# Altium schematic sheet SENSOR_INP.SchDoc
size A4; SheetNumber: 9; SheetTotal: 14
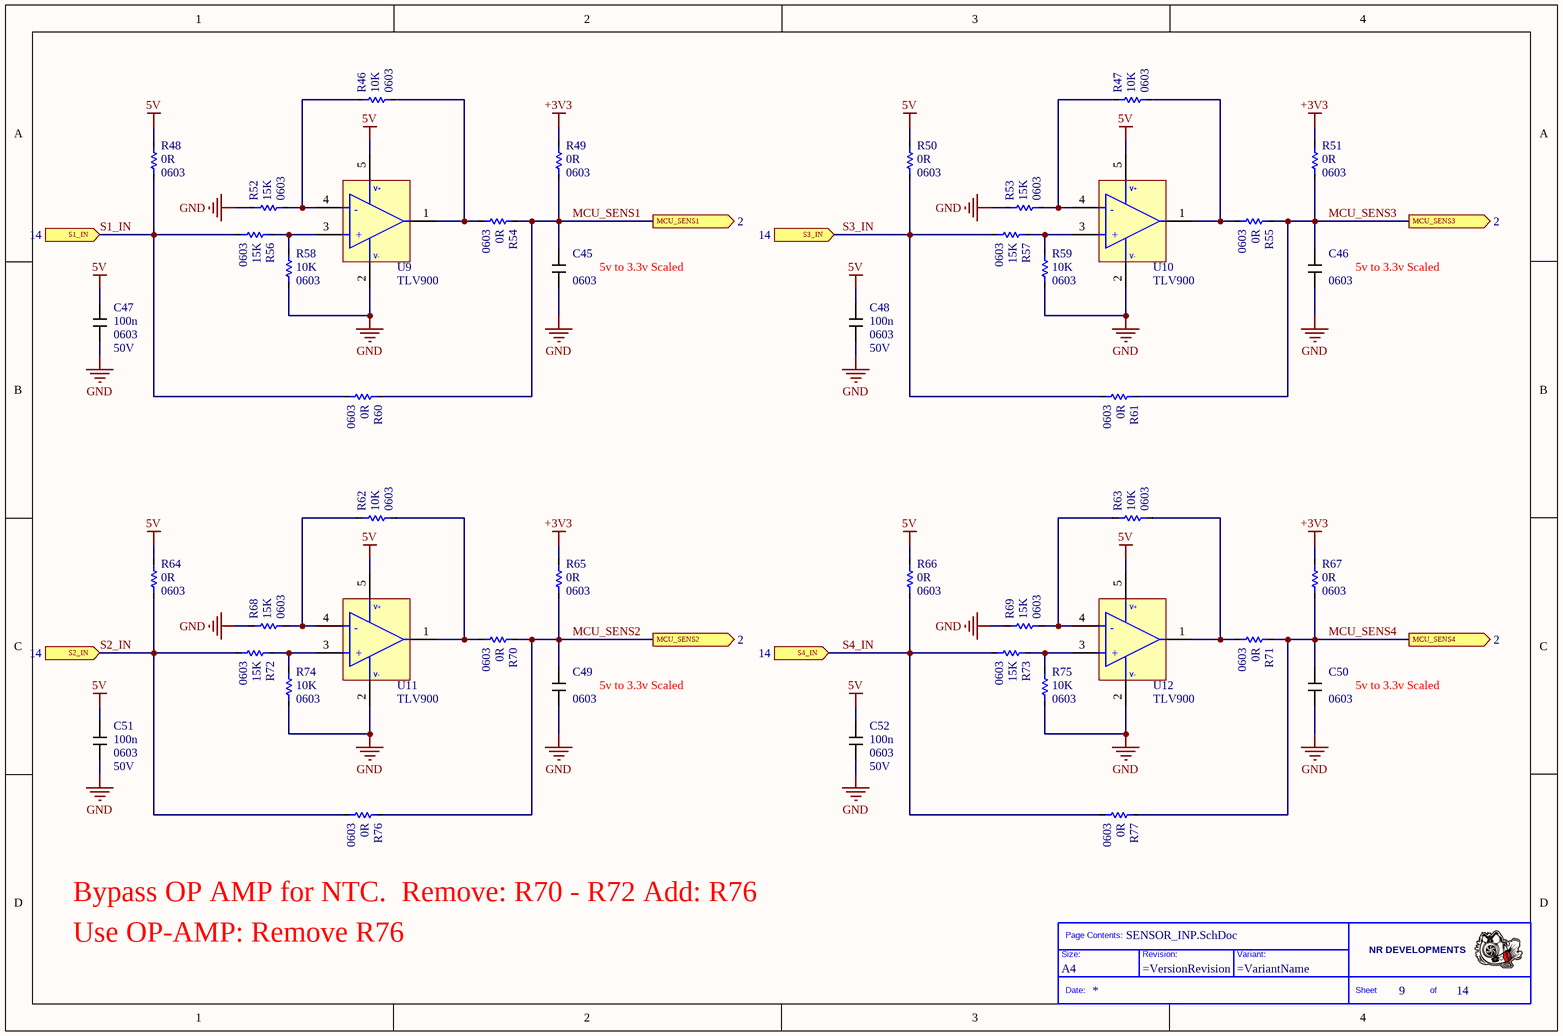
[diagram p0: SENSOR_INP.SchDoc]

## Parts
*?  Size: A4  (hidden comment: Title_Block)  (graphical)
C45  Case: 0603  [CAPC1608X09M]  (hidden comment: CAP)
C46  Case: 0603  [CAPC1608X09M]  (hidden comment: CAP)
C47  value 100n  Case: 0603  Voltage: 50V  [CAPC1608X09M]  (hidden comment: CAP)
C48  value 100n  Case: 0603  Voltage: 50V  [CAPC1608X09M]  (hidden comment: CAP)
C49  Case: 0603  [CAPC1608X09M]  (hidden comment: CAP)
C50  Case: 0603  [CAPC1608X09M]  (hidden comment: CAP)
C51  value 100n  Case: 0603  Voltage: 50V  [CAPC1608X09M]  (hidden comment: CAP)
C52  value 100n  Case: 0603  Voltage: 50V  [CAPC1608X09M]  (hidden comment: CAP)
R46  value 10K  Case: 0603  [RESC1608X06M]  (hidden comment: Res)
R47  value 10K  Case: 0603  [RESC1608X06M]  (hidden comment: Res)
R48  value 0R  Case: 0603  [RESC1608X06M]  (hidden comment: Res)
R49  value 0R  Case: 0603  [RESC1608X06M]  (hidden comment: Res)
R50  value 0R  Case: 0603  [RESC1608X06M]  (hidden comment: Res)
R51  value 0R  Case: 0603  [RESC1608X06M]  (hidden comment: Res)
R52  value 15K  Case: 0603  [RESC1608X06M]  (hidden comment: Res)
R53  value 15K  Case: 0603  [RESC1608X06M]  (hidden comment: Res)
R54  value 0R  Case: 0603  [RESC1608X06M]  (hidden comment: Res)
R55  value 0R  Case: 0603  [RESC1608X06M]  (hidden comment: Res)
R56  value 15K  Case: 0603  [RESC1608X06M]  (hidden comment: Res)
R57  value 15K  Case: 0603  [RESC1608X06M]  (hidden comment: Res)
R58  value 10K  Case: 0603  [RESC1608X06M]  (hidden comment: Res)
R59  value 10K  Case: 0603  [RESC1608X06M]  (hidden comment: Res)
R60  value 0R  Case: 0603  [RESC1608X06M]  (hidden comment: Res)
R61  value 0R  Case: 0603  [RESC1608X06M]  (hidden comment: Res)
R62  value 10K  Case: 0603  [RESC1608X06M]  (hidden comment: Res)
R63  value 10K  Case: 0603  [RESC1608X06M]  (hidden comment: Res)
R64  value 0R  Case: 0603  [RESC1608X06M]  (hidden comment: Res)
R65  value 0R  Case: 0603  [RESC1608X06M]  (hidden comment: Res)
R66  value 0R  Case: 0603  [RESC1608X06M]  (hidden comment: Res)
R67  value 0R  Case: 0603  [RESC1608X06M]  (hidden comment: Res)
R68  value 15K  Case: 0603  [RESC1608X06M]  (hidden comment: Res)
R69  value 15K  Case: 0603  [RESC1608X06M]  (hidden comment: Res)
R70  value 0R  Case: 0603  [RESC1608X06M]  (hidden comment: Res)
R71  value 0R  Case: 0603  [RESC1608X06M]  (hidden comment: Res)
R72  value 15K  Case: 0603  [RESC1608X06M]  (hidden comment: Res)
R73  value 15K  Case: 0603  [RESC1608X06M]  (hidden comment: Res)
R74  value 10K  Case: 0603  [RESC1608X06M]  (hidden comment: Res)
R75  value 10K  Case: 0603  [RESC1608X06M]  (hidden comment: Res)
R76  value 0R  Case: 0603  [RESC1608X06M]  (hidden comment: Res)
R77  value 0R  Case: 0603  [RESC1608X06M]  (hidden comment: Res)
U9  TLV900  [SOT95P280X145-5N]
U10  TLV900  [SOT95P280X145-5N]
U11  TLV900  [SOT95P280X145-5N]
U12  TLV900  [SOT95P280X145-5N]

## Ports
MCU_SENS1 (out, see 2), MCU_SENS2 (out, see 2), MCU_SENS3 (out, see 2), MCU_SENS4 (out, see 2), S1_IN (in, see 14), S2_IN (in, see 14), S3_IN (in, see 14), S4_IN (in, see 14)

## Nets
5V: C47.1 C48.1 C51.1 C52.1 R48.2 R50.2 R64.2 R66.2 U9.5(V+) U10.5(V+) U11.5(V+) U12.5(V+)
+3V3: R49.2 R51.2 R65.2 R67.2
GND: C45.2 C46.2 C47.2 C48.2 C49.2 C50.2 C51.2 C52.2 R52.2 R53.2 R58.1 R59.1 R68.2 R69.2 R74.1 R75.1 U9.2(V-) U10.2(V-) U11.2(V-) U12.2(V-)
MCU_SENS1: C45.1 R49.1 R54.2 R60.2 ; port MCU_SENS1
MCU_SENS2: C49.1 R65.1 R70.2 R76.2 ; port MCU_SENS2
MCU_SENS3: C46.1 R51.1 R55.2 R61.2 ; port MCU_SENS3
MCU_SENS4: C50.1 R67.1 R71.2 R77.2 ; port MCU_SENS4
S1_IN: R48.1 R56.1 R60.1 ; port S1_IN
S2_IN: R64.1 R72.1 R76.1 ; port S2_IN
S3_IN: R50.1 R57.1 R61.1 ; port S3_IN
S4_IN: R66.1 R73.1 R77.1 ; port S4_IN
NetR46_1: R46.1 R54.1 U9.1(OUTA)
NetR46_2: R46.2 R52.1 U9.4(IN-)
NetR47_1: R47.1 R55.1 U10.1(OUTA)
NetR47_2: R47.2 R53.1 U10.4(IN-)
NetR56_2: R56.2 R58.2 U9.3(IN+)
NetR57_2: R57.2 R59.2 U10.3(IN+)
NetR62_1: R62.1 R70.1 U11.1(OUTA)
NetR62_2: R62.2 R68.1 U11.4(IN-)
NetR63_1: R63.1 R71.1 U12.1(OUTA)
NetR63_2: R63.2 R69.1 U12.4(IN-)
NetR72_2: R72.2 R74.2 U11.3(IN+)
NetR73_2: R73.2 R75.2 U12.3(IN+)

## Notes on the sheet
- (near C45) 5v to 3.3v Scaled
- (near C46) 5v to 3.3v Scaled
- (near C49) 5v to 3.3v Scaled
- (near C50) 5v to 3.3v Scaled
- Bypass OP AMP for NTC.  Remove: R70 - R72 Add: R76
- Use OP-AMP: Remove R76
- (in symbol Title_Block) Page Contents:; NR DEVELOPMENTS; Size:; Revision:; Variant:; Date:; Sheet; of
- (in symbol TLV900) -; +

## Library data of the parts
C47 C48 C51 C52 = CAP: Manufacturer: KEMET; PartNumber: C0603C104K5RACTU
R46 R47 R58 R59 R62 R63 R74 R75 = Resistor: Manufacturer: YAGEO; PartNumber: AC0603FR-0710KL
R48-R51 R54 R55 R60 R61 R64-R67 R70 R71 R76 R77 = Resistor: Manufacturer: YAGEO; PartNumber: RC0603JR-070RL
R52 R53 R56 R57 R68 R69 R72 R73 = Resistor: Manufacturer: Vishay; PartNumber: CRCW060315K0FKEC
U9-U12 = TLV900: Amp. op. One-channel, 1-MHz rail-to-rail input and output 1.8-V to 5.5-V operational amplifier 5-SOT-23 -40 to 125; Manufacturer: Texas Instrument; PartNumber: TLV9001IDBVR; Value: TLV9001IDBVR; Case: SOT23-5